# Altium schematic sheet comparator_mezzanine.SchDoc
size A
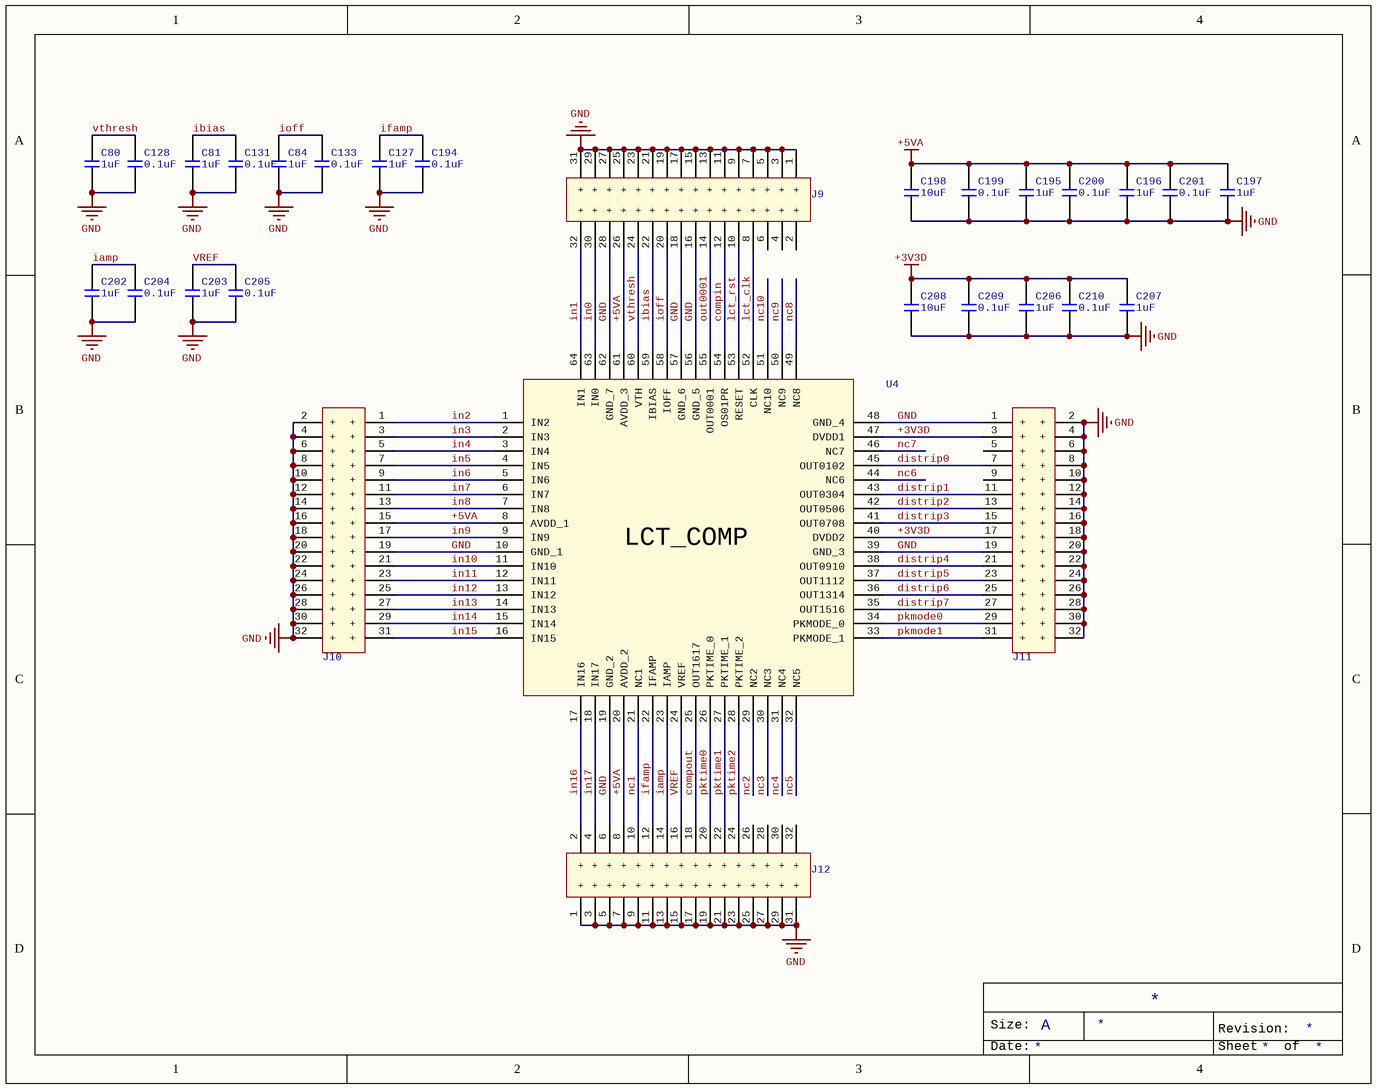
[diagram p0: comparator_mezzanine.SchDoc]

## Parts
C80  1uF  [C0603]
C81  1uF  [C0603]
C84  1uF  [C0603]
C127  1uF  [C0603]
C128  0.1uF  [C0603]
C131  0.1uF  [C0603]
C133  0.1uF  [C0603]
C194  0.1uF  [C0603]
C195  1uF  [C0603]
C196  1uF  [C0603]
C197  1uF  [C0603]
C198  10uF  [c1206]
C199  0.1uF  [C0603]
C200  0.1uF  [C0603]
C201  0.1uF  [C0603]
C202  1uF  [C0603]
C203  1uF  [C0603]
C204  0.1uF  [C0603]
C205  0.1uF  [C0603]
C206  1uF  [C0603]
C207  1uF  [C0603]
C208  10uF  [c1206]
C209  0.1uF  [C0603]
C210  0.1uF  [C0603]
J9  HEADER 16x02  [HEADER 16X02]  (value not drawn)
J10  HEADER 16x02  [HEADER 16X02]  (value not drawn)
J11  HEADER 16x02  [HEADER 16X02]  (value not drawn)
J12  HEADER 16x02  [HEADER 16X02]  (value not drawn)
U4  UCLA/LCT_COMP  [FPQ-64-0.8-10]  (value not drawn)

## Nets
+3V3D: C206.2 C207.2 C208.1 C209.2 C210.2 J11.3(+) J11.17(+) U4.40(DVDD2) U4.47(DVDD1)
+5VA: C195.2 C196.2 C197.2 C198.1 C199.2 C200.2 C201.2 J9.26(+) J10.15(+) J12.8(+) U4.8(AVDD_1) U4.20(AVDD_2) U4.61(AVDD_3)
GND: C80.1 C81.1 C84.1 C127.1 C128.1 C131.1 C133.1 C194.1 C195.1 C196.1 C197.1 C198.2 C199.1 C200.1 C201.1 C202.1 C203.1 C204.1 C205.1 C206.1 C207.1 C208.2 C209.1 C210.1 J9.1(+) J9.3(+) J9.5(+) J9.7(+) J9.9(+) J9.11(+) J9.13(+) J9.15(+) J9.16(+) J9.17(+) J9.18(+) J9.19(+) J9.21(+) J9.23(+) J9.25(+) J9.27(+) J9.28(+) J9.29(+) J9.31(+) J10.2(+) J10.4(+) J10.6(+) J10.8(+) J10.10(+) J10.12(+) J10.14(+) J10.16(+) J10.18(+) J10.19(+) J10.20(+) J10.22(+) J10.24(+) J10.26(+) J10.28(+) J10.30(+) J10.32(+) J11.1(+) J11.2(+) J11.4(+) J11.6(+) J11.8(+) J11.10(+) J11.12(+) J11.14(+) J11.16(+) J11.18(+) J11.19(+) J11.20(+) J11.22(+) J11.24(+) J11.26(+) J11.28(+) J11.30(+) J11.32(+) J12.1(+) J12.3(+) J12.5(+) J12.6(+) J12.7(+) J12.9(+) J12.11(+) J12.13(+) J12.15(+) J12.17(+) J12.19(+) J12.21(+) J12.23(+) J12.25(+) J12.27(+) J12.29(+) J12.31(+) U4.10(GND_1) U4.19(GND_2) U4.39(GND_3) U4.48(GND_4) U4.56(GND_5) U4.57(GND_6) U4.62(GND_7)
compin: J9.12(+) U4.54(OS01PR)
compout: J12.18(+) U4.25(OUT1617)
distrip0: J11.7(+) U4.45(OUT0102)
distrip1: J11.11(+) U4.43(OUT0304)
distrip2: J11.13(+) U4.42(OUT0506)
distrip3: J11.15(+) U4.41(OUT0708)
distrip4: J11.21(+) U4.38(OUT0910)
distrip5: J11.23(+) U4.37(OUT1112)
distrip6: J11.25(+) U4.36(OUT1314)
distrip7: J11.27(+) U4.35(OUT1516)
iamp: C202.2 C204.2 J12.14(+) U4.23(IAMP)
ibias: C81.2 C131.2 J9.22(+) U4.59(IBIAS)
ifamp: C127.2 C194.2 J12.12(+) U4.22(IFAMP)
in0: J9.30(+) U4.63(IN0)
in1: J9.32(+) U4.64(IN1)
in2: J10.1(+) U4.1(IN2)
in3: J10.3(+) U4.2(IN3)
in4: J10.5(+) U4.3(IN4)
in5: J10.7(+) U4.4(IN5)
in6: J10.9(+) U4.5(IN6)
in7: J10.11(+) U4.6(IN7)
in8: J10.13(+) U4.7(IN8)
in9: J10.17(+) U4.9(IN9)
in10: J10.21(+) U4.11(IN10)
in11: J10.23(+) U4.12(IN11)
in12: J10.25(+) U4.13(IN12)
in13: J10.27(+) U4.14(IN13)
in14: J10.29(+) U4.15(IN14)
in15: J10.31(+) U4.16(IN15)
in16: J12.2(+) U4.17(IN16)
in17: J12.4(+) U4.18(IN17)
ioff: C84.2 C133.2 J9.20(+) U4.58(IOFF)
lct_clk: J9.8(+) U4.52(CLK)
lct_rst: J9.10(+) U4.53(RESET)
nc1: J12.10(+) U4.21(NC1)
nc2: U4.29(NC2)
nc3: U4.30(NC3)
nc4: U4.31(NC4)
nc5: U4.32(NC5)
nc6: U4.44(NC6)
nc7: U4.46(NC7)
nc8: U4.49(NC8)
nc9: U4.50(NC9)
nc10: U4.51(NC10)
out0001: J9.14(+) U4.55(OUT0001)
pkmode0: J11.29(+) U4.34(PKMODE_0)
pkmode1: J11.31(+) U4.33(PKMODE_1)
pktime0: J12.20(+) U4.26(PKTIME_0)
pktime1: J12.22(+) U4.27(PKTIME_1)
pktime2: J12.24(+) U4.28(PKTIME_2)
VREF: C203.2 C205.2 J12.16(+) U4.24(VREF)
vthresh: C80.2 C128.2 J9.24(+) U4.60(VTH)

Not connected (* = marked no-connect by the designer): J9 2(+) 4(+) 6(+); J11 5(+) 9(+); J12 26(+) 28(+) 30(+) 32(+)

## Notes on the sheet
- Size:
- A
- Revision:
- Date:
- Sheet
- of
- (in symbol UCLA/LCT_COMP) LCT_COMP

## Library data of the parts
C80 C81 C84 C127 C195-C197 C202 C203 C206 C207 = Murata/GRM188R61E105KA12D: CAP2, CER, 1.0uF, 10%, 25V, 0603
C128 C131 C133 C194 C199-C201 C204 C205 C209 C210 = CAP/06035C104KAT2A: CAP-CER, 2, 0.1uF, 10%, 50V, 0603, X7R; Manufacturer: AVX Corporation; Capacitance: 0.10µF; Supplier 1: Digi-Key; Manufacturer Part Number: 06035C104KAT2A; RoHS: RoHS Compliant; Category: Capacitors; Stock 1: 4412408; Pricing 1: 1=0.1, 10=0.036, 25=0.0264, 50=0.0198, 100=0.0162, 250=0.01352, 500=0.01156, 1000=0.00908 (USD); Packaging: Cut Tape (CT); Tolerance: ±10%; Voltage - Rated: 50V; Temperature Coefficient: X7R; Mounting Type: Surface Mount, MLCC; Operating Temperature: -55°C ~ 125°C; Applications: General Purpose; Ratings: -; Package / Case: 0603 (1608 Metric); Size / Dimension: 0.063" L x 0.032" W (1.60mm x 0.81mm); Height - Seated (Max): -; Thickness (Max): 0.035" (0.90mm); Lead Spacing: -; Features: -; Lead Style: -; ComponentLink1URL: http://datasheets.avx.com/X7RDielectric.pdf; ComponentLink1Description: http://datasheets.avx.com/X7RDielectric.pdf; Supplier 2: Newark; Supplier Part Number 1: 478-5052-1-ND; Supplier Part Number 2: 54K2412
C198 C208 = CAP/GMK316F106ZL-T: CAP-CER, 2, 10uF, 10%, 35V, 1206; Manufacturer: Taiyo Yuden; Capacitance: 10µF; Tolerance: -20%, +80%; Temperature Coefficient: Y5V (F); Supplier 1: Digi-Key; Supplier Part Number 1: 587-1352-1-ND; Manufacturer Part Number: GMK316F106ZL-T; RoHS: RoHS Compliant; Category: Capacitors; Stock 1: 249989; Pricing 1: 1=0.46, 10=0.345, 50=0.2012, 100=0.161, 250=0.115, 500=0.0782, 1000=0.06325 (USD); Packaging: Cut Tape (CT); Voltage - Rated: 35V; Mounting Type: Surface Mount, MLCC; Operating Temperature: -30°C ~ 85°C; Applications: General Purpose; Ratings: -; Package / Case: 1206 (3216 Metric); Size / Dimension: 0.126" L x 0.063" W (3.20mm x 1.60mm); Height - Seated (Max): -; Thickness (Max): 0.071" (1.80mm); Lead Spacing: -; Features: -; Lead Style: -; ComponentLink1URL: http://ds.yuden.co.jp/TYCOMPAS/ut/detail.do?productNo=GMK316F106ZL-T&fileName=GMK316F106ZL-T_SS&mode=specSheetDownload; ComponentLink1Description: http://ds.yuden.co.jp/TYCOMPAS/ut/detail.do?productNo=GMK316F106ZL-T&fileName=GMK316F106ZL-T_SS&mode=specSheetDownload
U4 = UCLA/LCT_COMP: UCLA LCT Comparator